# Altium project power_board.PrjPcb
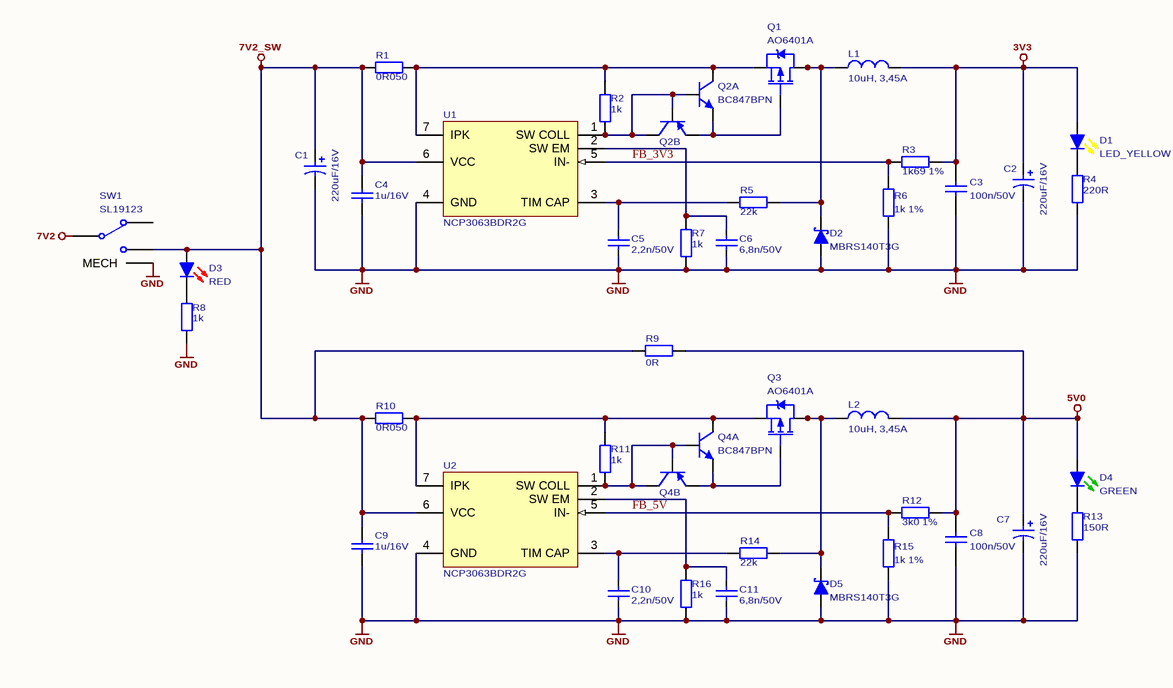
[diagram p0: power.SchDoc]
6 sheets, 120 parts. Net scope: global (net labels, ports and power ports of the same name join across sheets).
Board file: ie-tank-kit-pwr-1.PcbDoc
Sheets:
  power.SchDoc
  battery_protection.SchDoc
  motor_drivers.SchDoc
  lights.SchDoc
  mechanical.SchDoc
  main_connector.SchDoc

## Sheet power.SchDoc
size A4; Projectnumber: OWN-000; Size: A4

### Parts
C1  220uF/16V  [CES_E_8.3x8.3_6.2]
C2  220uF/16V  [CES_E_8.3x8.3_6.2]
C3  100n/50V  [C0805]
C4  1u/16V  [C0805]
C5  2,2n/50V  [C0805]
C6  6,8n/50V  [C0805]
C7  220uF/16V  [CES_E_8.3x8.3_6.2]
C8  100n/50V  [C0805]
C9  1u/16V  [C0805]
C10  2,2n/50V  [C0805]
C11  6,8n/50V  [C0805]
D1  LED_YELLOW  [LED0805Y]
D2  MBRS140T3G  [SMB]
D3  RED  [LED0805R]
D4  GREEN  [LED0805G]
D5  MBRS140T3G  [SMB]
L1  10uH, 3,45A  [PSDB1005]
L2  10uH, 3,45A  [PSDB1005]
Q1  AO6401A  [SOT-23-6]
Q2  BC847BPN  [SOT-323-6 (SOT-363, SC88, SC70-6)]  (parts A,B of 2)
Q3  AO6401A  [SOT-23-6]
Q4  BC847BPN  [SOT-323-6 (SOT-363, SC88, SC70-6)]  (parts A,B of 2)
R1  0R050  [R0805]
R2  1k  [R0805]
R3  1k69 1%  [R0805]
R4  220R  [R0805]
R5  22k  [R0805]
R6  1k 1%  [R0805]
R7  1k  [R0805]
R8  1k  [R0805]
R9  0R  [R1206]
R10  0R050  [R0805]
R11  1k  [R0805]
R12  3k0 1%  [R0805]
R13  150R  [R0805]
R14  22k  [R0805]
R15  1k 1%  [R0805]
R16  1k  [R0805]
SW1  SL19123  [500SSPxS1M6xEA]
U1  NCP3063BDR2G  [SO8]
U2  NCP3063BDR2G  [SO8]

### Nets
3V3: C2.1 C3.2 D1.1(A) L1.2 R3.2
5V0: C7.1 C8.2 D4.1(A) L2.2 R9.2 R12.2
7V2: SW1.2
7V2_SW: C1.1 C4.2 C9.2 D3.1(A) R1.1 R9.1 R10.1 SW1.3 U1.6(VCC) U2.6(VCC)
GND: C1.2 C2.2 C3.1 C4.1 C5.1 C6.1 C7.2 C8.1 C9.1 C10.1 C11.1 D2.1(A) D5.1(A) R4.2 R6.2 R7.2 R8.2 R13.2 R15.2 R16.2 SW1.M(MECH) U1.4(GND) U2.4(GND)
FB_3V3: R3.1 R6.1 U1.5(IN-)
FB_5V: R12.1 R15.1 U2.5(IN-)
NetC5_2: C5.2 R5.2 U1.3(TIM_CAP)
NetC6_2: C6.2 R7.1 U1.2(SW_EM)
NetC10_2: C10.2 R14.2 U2.3(TIM_CAP)
NetC11_2: C11.2 R16.1 U2.2(SW_EM)
NetD1_2: D1.2(K) R4.1
NetD2_2: D2.2(K) L1.1 Q1.1(D) Q1.2(D) Q1.5(D) Q1.6(D) R5.1
NetD3_2: D3.2(K) R8.1
NetD4_2: D4.2(K) R13.1
NetD5_2: D5.2(K) L2.1 Q3.1(D) Q3.2(D) Q3.5(D) Q3.6(D) R14.1
NetQ1_3: Q1.3(G) Q2.1(EA) Q2.4(EB)
NetQ1_4: Q1.4(S) Q2.6(CA) R1.2 R2.1 U1.7(IPK)
NetQ2_2: Q2.2(BA) Q2.3(CB) Q2.5(BB) R2.2 U1.1(SW_COLL)
NetQ3_3: Q3.3(G) Q4.1(EA) Q4.4(EB)
NetQ3_4: Q3.4(S) Q4.6(CA) R10.2 R11.1 U2.7(IPK)
NetQ4_2: Q4.2(BA) Q4.3(CB) Q4.5(BB) R11.2 U2.1(SW_COLL)

Not connected (* = marked no-connect by the designer): SW1 1

### Notes on the sheet
- PROJECT NAME:
- PROJECT NO.:
- DATE:
- TITLE:
- SHEET
- of
- DRAWN BY:
- REVISION:
- FILENAME:
- A4

### Library data of the parts
C1 C2 C7 = Cap Pol: Polarized Capacitor; ComponentLink1Description: datasheet; ComponentLink2Description: supplier; Value: 220uF/16V
C3-C6 C8-C11 = Cap: Capacitor; ComponentLink1Description: datasheet; ComponentLink2Description: supplier
  C3 C8: Value: 100n/50V
  C4 C9: Value: 1u/16V
  C5 C10: Value: 2,2n/50V
  C6 C11: Value: 6,8n/50V
D1 = LED_YELLOW: YELLOW LED; Published: 04-Apr-2006
D2 D5 = MBRS140T3G: Schottky barrier rectifier: 40V, 1A; Published: 22-Nov-2006; PackageReference: SMB; Supplier 1: TME; Supplier 2: Farnell; Supplier Part Number 1: MBRS140T3G; Supplier Part Number 2: 1467526
D3 = LED_RED: RED LED; Published: 04-Apr-2006
D4 = LED_GREEN: GREEN LED; Published: 04-Apr-2006
L1 L2 = PSDB1005NT100: 10uH, 20%, 3,45A, PSDB1005N Series Inductor; Published: 08-Mar-2006; ComponentLink1Description: datasheet; ComponentLink2Description: supplier; Supplier 1: TME; Supplier Part Number 1: PSDB1005NT100; Value: 10uH, 3,45A
Q1 Q3 = AO6401A: P-Channel MOSFET; -60V, -5A, 1.3W;; Supplier 1: TME; Supplier Part Number 1: AO6401A
Q2 Q4 = BC847BPN: PNP/NPN General Purpose Transistor (VCE=45V, IC=100mA); Supplier 1: TME; Supplier 2: Farnell; Supplier 3: Farnell; Supplier 4: Farnell; Supplier Part Number 1: BC847BPN.115; Supplier Part Number 2: 2336824; Supplier Part Number 3: 1081233RL; Supplier Part Number 4: 1081233
R1-R16 = Res: Resistor; Published: 19-Feb-2006; ComponentLink1Description: datasheet; ComponentLink2Description: supplier
  R1 R10: Value: 0R050
  R2 R7 R8 R11 R16: Value: 1k
  R3: Value: 1k69 1%
  R4: Value: 220R
  R5 R14: Value: 22k
  R6 R15: Value: 1k 1%
  R9: Value: 0R
  R12: Value: 3k0 1%
  R13: Value: 150R
SW1 = SL19123: Canal Electronic SPDT AC: 3A/250V, DC: 6A/28V; Supplier 1: TME; Supplier Part Number 1: SL19123
U1 U2 = NCP3063BDR2G: DC-DC Converter NCP3063BDR2G (Farnell 1547126); Published: 22-Nov-2006; PackageReference: SO8; Supplier 1: Farnell; Supplier 2: Farnell; Supplier 3: Farnell; Supplier Part Number 1: 1547126; Supplier Part Number 2: 2126136; Supplier Part Number 3: 1547126RL

## Sheet battery_protection.SchDoc
size A4; Projectnumber: OWN-000; Size: A4
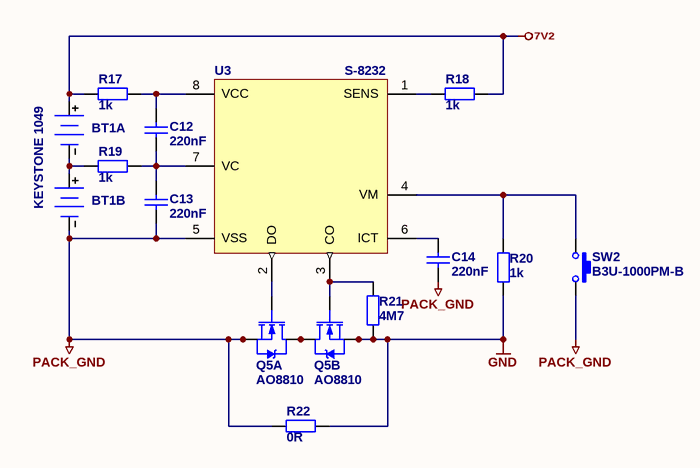
[diagram p1: battery_protection.SchDoc]

### Parts
BT1  KEYSTONE 1049  [KEYSTONE_1049]  (parts A,B of 2)  (no BOM)
C12  220nF  [C0805]
C13  220nF  [C0805]
C14  220nF  [C0805]
Q5  AO8810  [TSSOP8]  (parts A,B of 2)
R17  1k  [R0805]
R18  1k  [R0805]
R19  1k  [R0805]
R20  1k  [R0805]
R21  4M7  [R0805]
R22  0R  [R0805]
SW2  B3U-1000PM-B  [B3U-1000PM-B]
U3  S-8232  [TSSOP8]

### Nets
7V2: BT1.1(+) R17.1 R18.2
GND: Q5.6(S2) Q5.7(S2) R20.2 R21.2 R22.1
PACK_GND: BT1.3(-) C13.1 C14.1 Q5.2(S1) Q5.3(S1) R22.2 SW2.2 U3.5(VSS)
NetBT1_2: BT1.2(-) BT1.4(+) R19.1
NetC12_1: C12.1 C13.2 R19.2 U3.7(VC)
NetC12_2: C12.2 R17.2 U3.8(VCC)
NetC14_2: C14.2 U3.6(ICT)
NetQ5_1: Q5.1(D1/D2) Q5.8(D1/D3)
NetQ5_4: Q5.4(G1) U3.2(DO)
NetQ5_5: Q5.5(G2) R21.1 U3.3(CO)
NetR18_1: R18.1 U3.1(SENS)
NetR20_1: R20.1 SW2.1 U3.4(VM)

### Notes on the sheet
- PROJECT NAME:
- PROJECT NO.:
- DATE:
- TITLE:
- SHEET
- of
- DRAWN BY:
- REVISION:
- FILENAME:
- A4

### Library data of the parts
BT1 = Keystone 1049: 2x 18650 LiPo Acu in the KEYSTONE 1049 Holder; Published: 14-Sep-2006
C12-C14 = Cap: Capacitor; ComponentLink1Description: datasheet; ComponentLink2Description: supplier; Value: 220nF
Q5 = AO8810: Dual Common Drain N-Channel MOSFET: Vds=20V, Rdson<20mR@4,5V, Id=7A; Published: 20-Mar-2006; Package Reference: TSOP6 (SOT23-6); Supplier 1: TME; Supplier Part Number 1: AO8810
R17-R22 = Res: Resistor; Published: 19-Feb-2006; ComponentLink1Description: datasheet; ComponentLink2Description: supplier
  R17-R20: Value: 1k
  R21: Value: 4M7
  R22: Value: 0R
SW2 = B3U-1000PM-B: OMRON Ultra-small Tactile Switch - 12V/50mA
U3 = S-8232: Battery Protection IC For 2-Serial-Cell Pack

## Sheet motor_drivers.SchDoc: X
size A4; Date: DD-MM-YYYY; CheckedBy: X; DrawnBy: Y; Revision: 0.0.0; SheetNumber: X; SheetTotal: Y; Projectnumber: OWN-000; Size: A4; Projectname: X
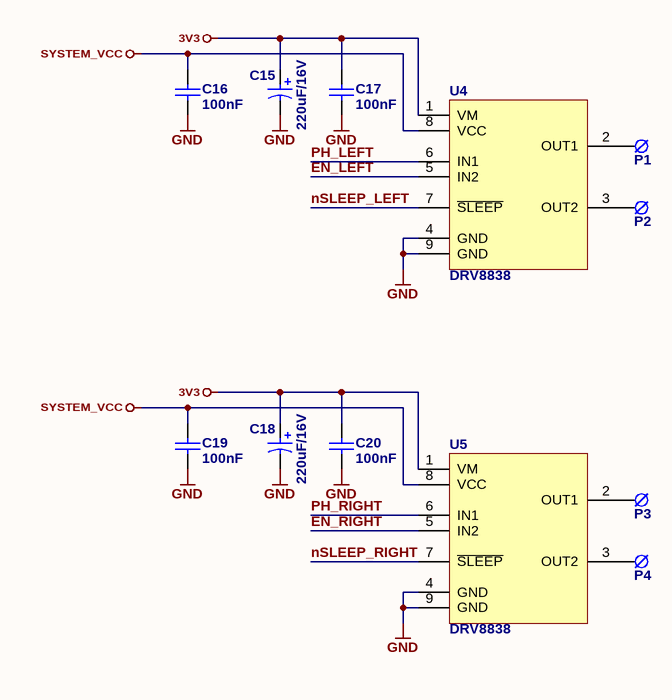
[diagram p2: motor_drivers.SchDoc]

### Parts
C15  220uF/16V  [CES_E_8.3x8.3_6.2]
C16  100nF  [C0805]
C17  100nF  [C0805]
C18  220uF/16V  [CES_E_8.3x8.3_6.2]
C19  100nF  [C0805]
C20  100nF  [C0805]
P1  CablePAD  [PADTHT1.5x3mm]  (value not drawn)  (no BOM)
P2  CablePAD  [PADTHT1.5x3mm]  (value not drawn)  (no BOM)
P3  CablePAD  [PADTHT1.5x3mm]  (value not drawn)  (no BOM)
P4  CablePAD  [PADTHT1.5x3mm]  (value not drawn)  (no BOM)
U4  DRV8838  [WSON8 (DSG8-1600X900TP)]
U5  DRV8838  [WSON8 (DSG8-1600X900TP)]

### Nets
3V3: C15.1 C17.2 C18.1 C20.2 U4.1(VM) U5.1(VM)
GND: C15.2 C16.1 C17.1 C18.2 C19.1 C20.1 U4.4(GND) U4.9(GND) U5.4(GND) U5.9(GND)
SYSTEM_VCC: C16.2 C19.2 U4.8(VCC) U5.8(VCC)
EN_LEFT: U4.5(IN2)
EN_RIGHT: U5.5(IN2)
nSLEEP_LEFT: U4.7(~{SLEEP})
nSLEEP_RIGHT: U5.7(~{SLEEP})
PH_LEFT: U4.6(IN1)
PH_RIGHT: U5.6(IN1)
NetP1_0: P1.0 U4.2(OUT1)
NetP2_0: P2.0 U4.3(OUT2)
NetP3_0: P3.0 U5.2(OUT1)
NetP4_0: P4.0 U5.3(OUT2)

### Notes on the sheet
- PROJECT NAME:
- PROJECT NO.:
- DATE:
- TITLE:
- SHEET
- of
- DRAWN BY:
- REVISION:
- FILENAME:
- A4

### Library data of the parts
C15 C18 = Cap Pol: Polarized Capacitor; ComponentLink1Description: datasheet; ComponentLink2Description: supplier; Value: 220uF/16V
C16 C17 C19 C20 = Cap: Capacitor; ComponentLink1Description: datasheet; ComponentLink2Description: supplier; Value: 100nF
P1-P4 = CablePAD: Cable/Wire Soldering PAD; Published: 14-Sep-2006
U4 U5 = DRV8838: Low-Voltage H-Bridge Driver; Published: 14-Sep-2006; Supplier 1: Farnell; Supplier 2: Farnell; Supplier Part Number 1: 2420232; Supplier Part Number 2: 2542736

## Sheet lights.SchDoc: X
size A4; Date: DD-MM-YYYY; CheckedBy: X; DrawnBy: Y; Revision: 0.0.0; SheetNumber: X; SheetTotal: Y; Projectnumber: OWN-000; Size: A4; Projectname: X
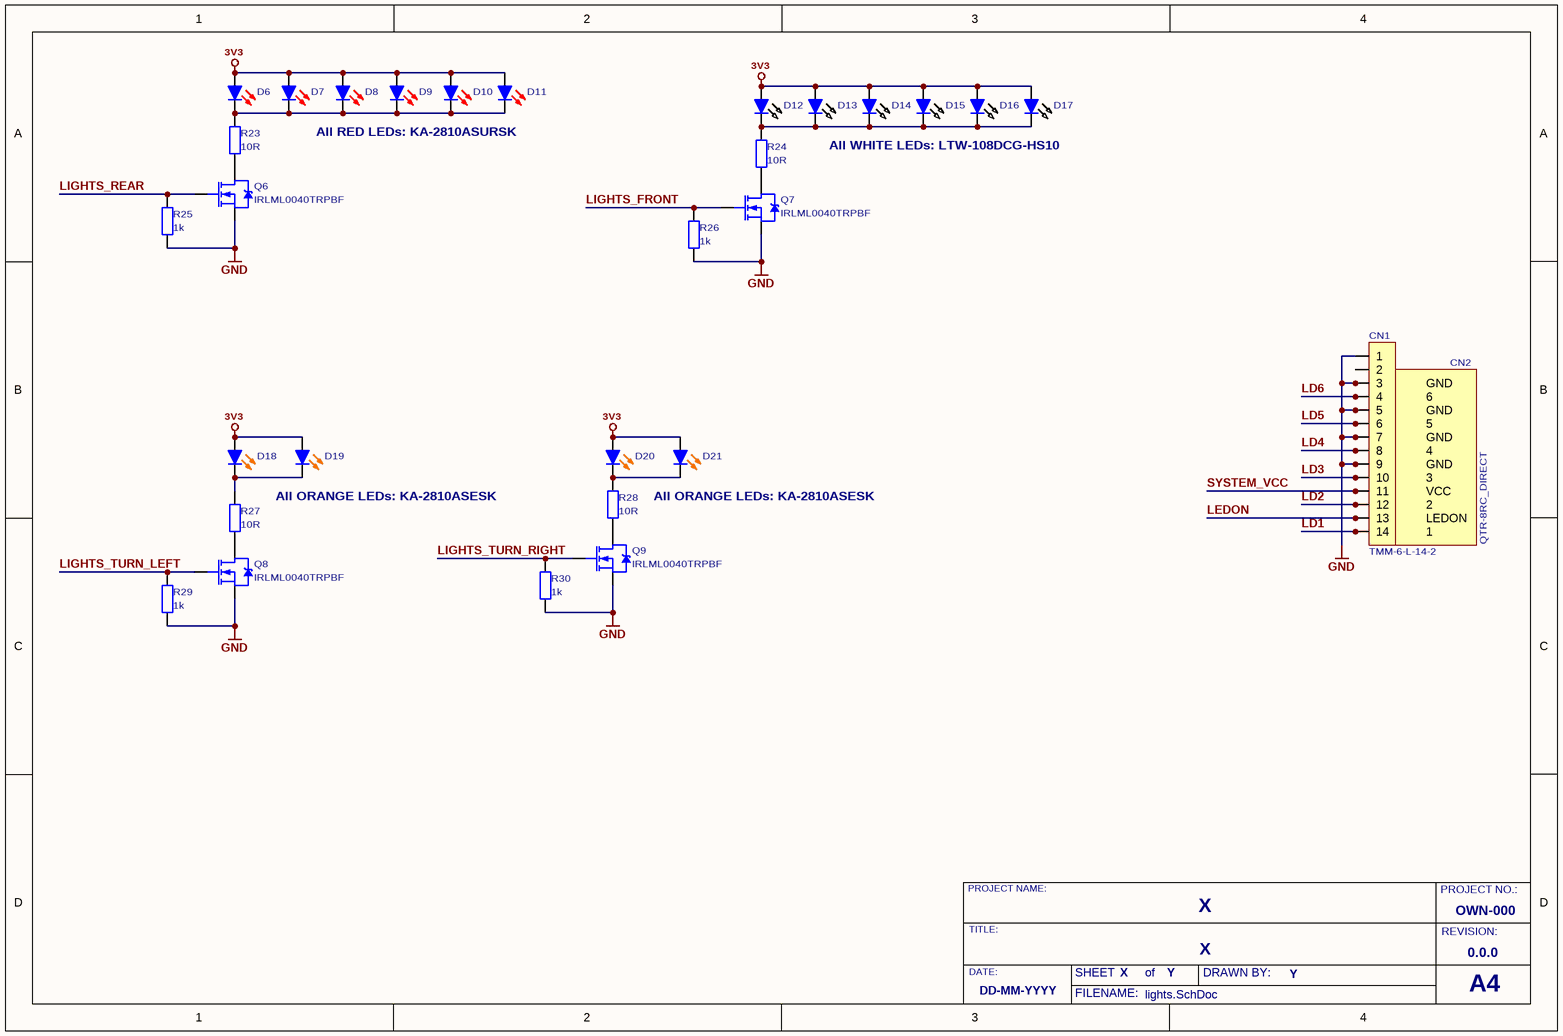
[diagram p3: lights.SchDoc]

### Parts
CN1  TMM-6-L-14-2  [MM_14_SMD_LCK]
CN2  QTR-8RC_DIRECT  [QTR-8RC_SNAPPED_GOLDPIN_VERTICAL]
D6  KA-2810ASURSK  [LED2810]  (value not drawn)
D7  KA-2810ASURSK  [LED2810]  (value not drawn)
D8  KA-2810ASURSK  [LED2810]  (value not drawn)
D9  KA-2810ASURSK  [LED2810]  (value not drawn)
D10  KA-2810ASURSK  [LED2810]  (value not drawn)
D11  KA-2810ASURSK  [LED2810]  (value not drawn)
D12  LTW-108DCG-HS10  [LED2810]  (value not drawn)
D13  LTW-108DCG-HS10  [LED2810]  (value not drawn)
D14  LTW-108DCG-HS10  [LED2810]  (value not drawn)
D15  LTW-108DCG-HS10  [LED2810]  (value not drawn)
D16  LTW-108DCG-HS10  [LED2810]  (value not drawn)
D17  LTW-108DCG-HS10  [LED2810]  (value not drawn)
D18  KA-2810ASESK  [LED2810]  (value not drawn)
D19  KA-2810ASESK  [LED2810]  (value not drawn)
D20  KA-2810ASESK  [LED2810]  (value not drawn)
D21  KA-2810ASESK  [LED2810]  (value not drawn)
Q6  IRLML0040TRPBF  [SOT-23]
Q7  IRLML0040TRPBF  [SOT-23]
Q8  IRLML0040TRPBF  [SOT-23]
Q9  IRLML0040TRPBF  [SOT-23]
R23  10R  [R0805]
R24  10R  [R0805]
R25  1k  [R0805]
R26  1k  [R0805]
R27  10R  [R0805]
R28  10R  [R0805]
R29  1k  [R0805]
R30  1k  [R0805]

### Nets
3V3: D6.2(A) D7.2(A) D8.2(A) D9.2(A) D10.2(A) D11.2(A) D12.2(A) D13.2(A) D14.2(A) D15.2(A) D16.2(A) D17.2(A) D18.2(A) D19.2(A) D20.2(A) D21.2(A)
GND: CN1.1 CN1.3 CN1.5 CN1.7 CN1.9 CN2.GND Q6.2(S) Q7.2(S) Q8.2(S) Q9.2(S) R25.2 R26.2 R29.2 R30.2
SYSTEM_VCC: CN1.11 CN2.VCC
LD1: CN1.14 CN2.1
LD2: CN1.12 CN2.2
LD3: CN1.10 CN2.3
LD4: CN1.8 CN2.4
LD5: CN1.6 CN2.5
LD6: CN1.4 CN2.6
LEDON: CN1.13 CN2.LEDON
LIGHTS_FRONT: Q7.1(G) R26.1
LIGHTS_REAR: Q6.1(G) R25.1
LIGHTS_TURN_LEFT: Q8.1(G) R29.1
LIGHTS_TURN_RIGHT: Q9.1(G) R30.1
NetD6_1: D6.1(K) D7.1(K) D8.1(K) D9.1(K) D10.1(K) D11.1(K) R23.1
NetD12_1: D12.1(K) D13.1(K) D14.1(K) D15.1(K) D16.1(K) D17.1(K) R24.1
NetD18_1: D18.1(K) D19.1(K) R27.1
NetD20_1: D20.1(K) D21.1(K) R28.1
NetQ6_3: Q6.3(D) R23.2
NetQ7_3: Q7.3(D) R24.2
NetQ8_3: Q8.3(D) R27.2
NetQ9_3: Q9.3(D) R28.2

Not connected (* = marked no-connect by the designer): CN1 2

### Notes on the sheet
- All RED LEDs: KA-2810ASURSK
- All WHITE LEDs: LTW-108DCG-HS10
- All ORANGE LEDs: KA-2810ASESK
- PROJECT NAME:
- PROJECT NO.:
- DATE:
- TITLE:
- SHEET
- of
- DRAWN BY:
- REVISION:
- FILENAME:
- A4

### Library data of the parts
CN1 = TMM-6-L-14-2: 14-pin MicroMarch Female Socket With Locking Mechanism, Vertical, SMD
CN2 = QTR-8RC_DIRECT: QTR-8RC Reflectance Sensor Array (Pololu item No. 961); Published: 14-Sep-2006
Q6-Q9 = IRLML0040TRPBF: N-Channel; 40V, 3.6A, 1,25W; HEXFET Power MOS-FET; Supplier 1: Farnell; Supplier 2: TME; Supplier 3: Farnell; Supplier 4: Farnell; Supplier Part Number 1: 1831088RL; Supplier Part Number 2: IRLML0040TRPBF; Supplier Part Number 3: 1829136; Supplier Part Number 4: 1831088
R23-R30 = Res: Resistor; Published: 19-Feb-2006; ComponentLink1Description: datasheet; ComponentLink2Description: supplier
  R23 R24 R27 R28: Value: 10R
  R25 R26 R29 R30: Value: 1k
D6-D11 = KA-2810ASURSK: Published: 04-Apr-2006
D12-D17 = LTW-108DCG-HS10: Published: 04-Apr-2006
D18-D21 = KA-2810ASESK: Published: 04-Apr-2006

## Sheet mechanical.SchDoc
size A4
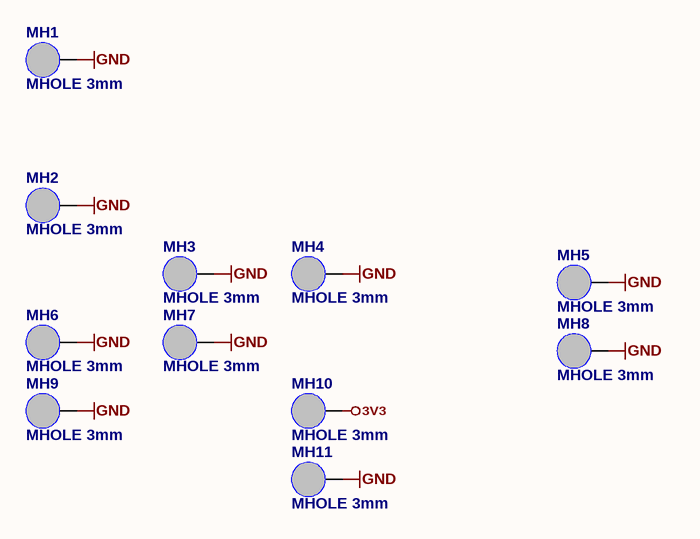
[diagram p4: mechanical.SchDoc]

### Parts
MH1  MHOLE 3mm  [3mm screw drill I]  (no BOM)
MH2  MHOLE 3mm  [3mm screw drill I]  (no BOM)
MH3  MHOLE 3mm  [3mm screw drill I]  (no BOM)
MH4  MHOLE 3mm  [3mm screw drill I]  (no BOM)
MH5  MHOLE 3mm  [3mm screw drill I]  (no BOM)
MH6  MHOLE 3mm  [3mm screw drill I]  (no BOM)
MH7  MHOLE 3mm  [3mm screw drill I]  (no BOM)
MH8  MHOLE 3mm  [3mm screw drill I]  (no BOM)
MH9  MHOLE 3mm  [3mm screw drill I]  (no BOM)
MH10  MHOLE 3mm  [3mm screw drill I]  (no BOM)
MH11  MHOLE 3mm  [3mm screw drill I]  (no BOM)

### Nets
3V3: MH10.1(GND)
GND: MH1.1(GND) MH2.1(GND) MH3.1(GND) MH4.1(GND) MH5.1(GND) MH6.1(GND) MH7.1(GND) MH8.1(GND) MH9.1(GND) MH11.1(GND)

### Library data of the parts
MH1-MH11 = MHOLE_3MM: 3mm Mounting Hole

## Sheet main_connector.SchDoc: X
size A4; Date: DD-MM-YYYY; CheckedBy: X; DrawnBy: Y; Revision: 0.0.0; SheetNumber: X; SheetTotal: Y; Projectnumber: OWN-000; Size: A4; Projectname: X
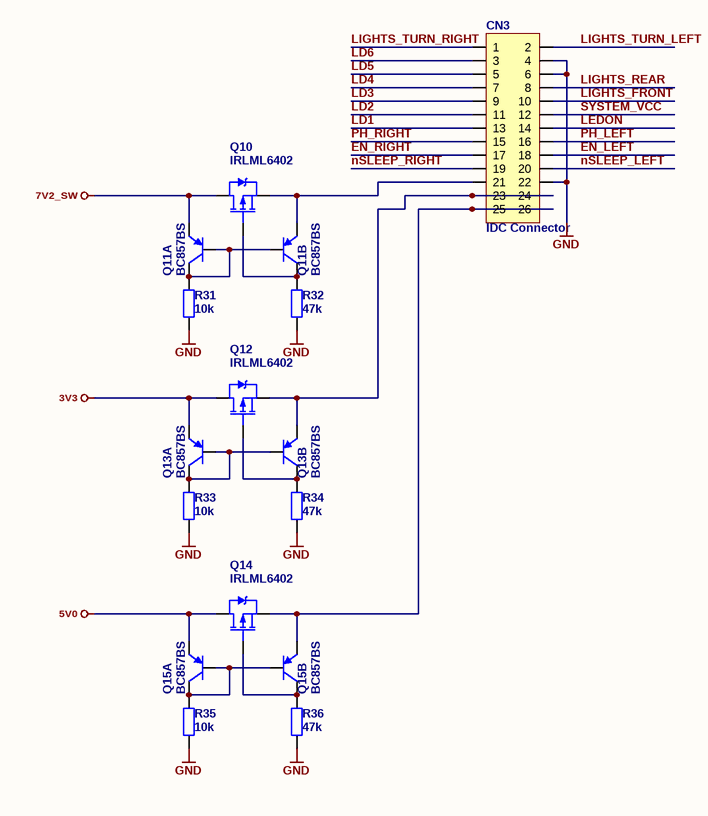
[diagram p5: main_connector.SchDoc]

### Parts
CN3  IDC Connector  [IDC26_RA_LONG_W_CN]
Q10  IRLML6402  [SOT-23]
Q11  BC857BS  [SOT-323-6 (SOT-363, SC88, SC70-6)]  (parts A,B of 2)
Q12  IRLML6402  [SOT-23]
Q13  BC857BS  [SOT-323-6 (SOT-363, SC88, SC70-6)]  (parts A,B of 2)
Q14  IRLML6402  [SOT-23]
Q15  BC857BS  [SOT-323-6 (SOT-363, SC88, SC70-6)]  (parts A,B of 2)
R31  10k  [R0805]
R32  47k  [R0805]
R33  10k  [R0805]
R34  47k  [R0805]
R35  10k  [R0805]
R36  47k  [R0805]

### Nets
3V3: Q12.3(D) Q13.1(EA)
5V0: Q14.3(D) Q15.1(EA)
7V2_SW: Q10.3(D) Q11.1(EA)
GND: CN3.4 CN3.6 CN3.22 R31.1 R32.1 R33.1 R34.1 R35.1 R36.1
SYSTEM_VCC: CN3.12
EN_LEFT: CN3.18
EN_RIGHT: CN3.17
LD1: CN3.13
LD2: CN3.11
LD3: CN3.9
LD4: CN3.7
LD5: CN3.5
LD6: CN3.3
LEDON: CN3.14
LIGHTS_FRONT: CN3.10
LIGHTS_REAR: CN3.8
LIGHTS_TURN_LEFT: CN3.2
LIGHTS_TURN_RIGHT: CN3.1
nSLEEP_LEFT: CN3.20
nSLEEP_RIGHT: CN3.19
PH_LEFT: CN3.16
PH_RIGHT: CN3.15
NetCN3_21: CN3.21 Q10.2(S) Q11.4(EB)
NetCN3_23: CN3.23 CN3.24 Q12.2(S) Q13.4(EB)
NetCN3_25: CN3.25 CN3.26 Q14.2(S) Q15.4(EB)
NetQ10_1: Q10.1(G) Q11.3(CB) R32.2
NetQ11_2: Q11.2(BA) Q11.5(BB) Q11.6(CA) R31.2
NetQ12_1: Q12.1(G) Q13.3(CB) R34.2
NetQ13_2: Q13.2(BA) Q13.5(BB) Q13.6(CA) R33.2
NetQ14_1: Q14.1(G) Q15.3(CB) R36.2
NetQ15_2: Q15.2(BA) Q15.5(BB) Q15.6(CA) R35.2

### Notes on the sheet
- PROJECT NAME:
- PROJECT NO.:
- DATE:
- TITLE:
- SHEET
- of
- DRAWN BY:
- REVISION:
- FILENAME:
- A4

### Library data of the parts
CN3 = CN_13x2
Q10 Q12 Q14 = IRLML6402: P-Channel; -20V, -3.7A, 1.3W; HEXFET Power MOS-FET
Q11 Q13 Q15 = BC857BS: 2xPNP General Purpose Transistor (VCE=-45V, IC=-100mA)
R31-R36 = Res: Resistor; Published: 19-Feb-2006; ComponentLink1Description: datasheet; ComponentLink2Description: supplier
  R31 R33 R35: Value: 10k
  R32 R34 R36: Value: 47k

## Nets that join several sheets
3V3: power (5 pins), motor_drivers (6 pins), lights (16 pins), mechanical (MH10.1), main_connector (Q12.3 Q13.1)
5V0: power (6 pins), main_connector (Q14.3 Q15.1)
7V2: power (SW1.2), battery_protection (BT1.1 R17.1 R18.2)
7V2_SW: power (10 pins), main_connector (Q10.3 Q11.1)
GND: power (23 pins), battery_protection (5 pins), motor_drivers (10 pins), lights (14 pins), mechanical (10 pins), main_connector (9 pins)
SYSTEM_VCC: motor_drivers (C16.2 C19.2 U4.8 U5.8), lights (CN1.11 CN2.VCC), main_connector (CN3.12)
EN_LEFT: motor_drivers (U4.5), main_connector (CN3.18)
EN_RIGHT: motor_drivers (U5.5), main_connector (CN3.17)
LD1: lights (CN1.14 CN2.1), main_connector (CN3.13)
LD2: lights (CN1.12 CN2.2), main_connector (CN3.11)
LD3: lights (CN1.10 CN2.3), main_connector (CN3.9)
LD4: lights (CN1.8 CN2.4), main_connector (CN3.7)
LD5: lights (CN1.6 CN2.5), main_connector (CN3.5)
LD6: lights (CN1.4 CN2.6), main_connector (CN3.3)
LEDON: lights (CN1.13 CN2.LEDON), main_connector (CN3.14)
LIGHTS_FRONT: lights (Q7.1 R26.1), main_connector (CN3.10)
LIGHTS_REAR: lights (Q6.1 R25.1), main_connector (CN3.8)
LIGHTS_TURN_LEFT: lights (Q8.1 R29.1), main_connector (CN3.2)
LIGHTS_TURN_RIGHT: lights (Q9.1 R30.1), main_connector (CN3.1)
nSLEEP_LEFT: motor_drivers (U4.7), main_connector (CN3.20)
nSLEEP_RIGHT: motor_drivers (U5.7), main_connector (CN3.19)
PH_LEFT: motor_drivers (U4.6), main_connector (CN3.16)
PH_RIGHT: motor_drivers (U5.6), main_connector (CN3.15)

## Assembly variants
simple: not fitted C10 C11 C12 C13 C14 C15 C16 C17 C18 C19 D4 D5 L2 Q3 Q4 Q7 R10 R11 R12 R13 R14 R15 R16 R17 R18 R19 R20 R21 U2 U3
full: not fitted R9 R22